# Altium schematic sheet Serial IO Interface2.SchDoc: Cypress Molson - Serial I/O Interface (Secondary)
size C; CompanyName: Linear Systems Ltd.; Organization: Linear Systems Ltd.; Address1: 1-1717 Dublin Ave.; Address2: Winnipeg, MB, Canada; Address3: R3H 0H2; DocumentNumber: LS7652; Revision: 1; SheetNumber: 11; SheetTotal: 12
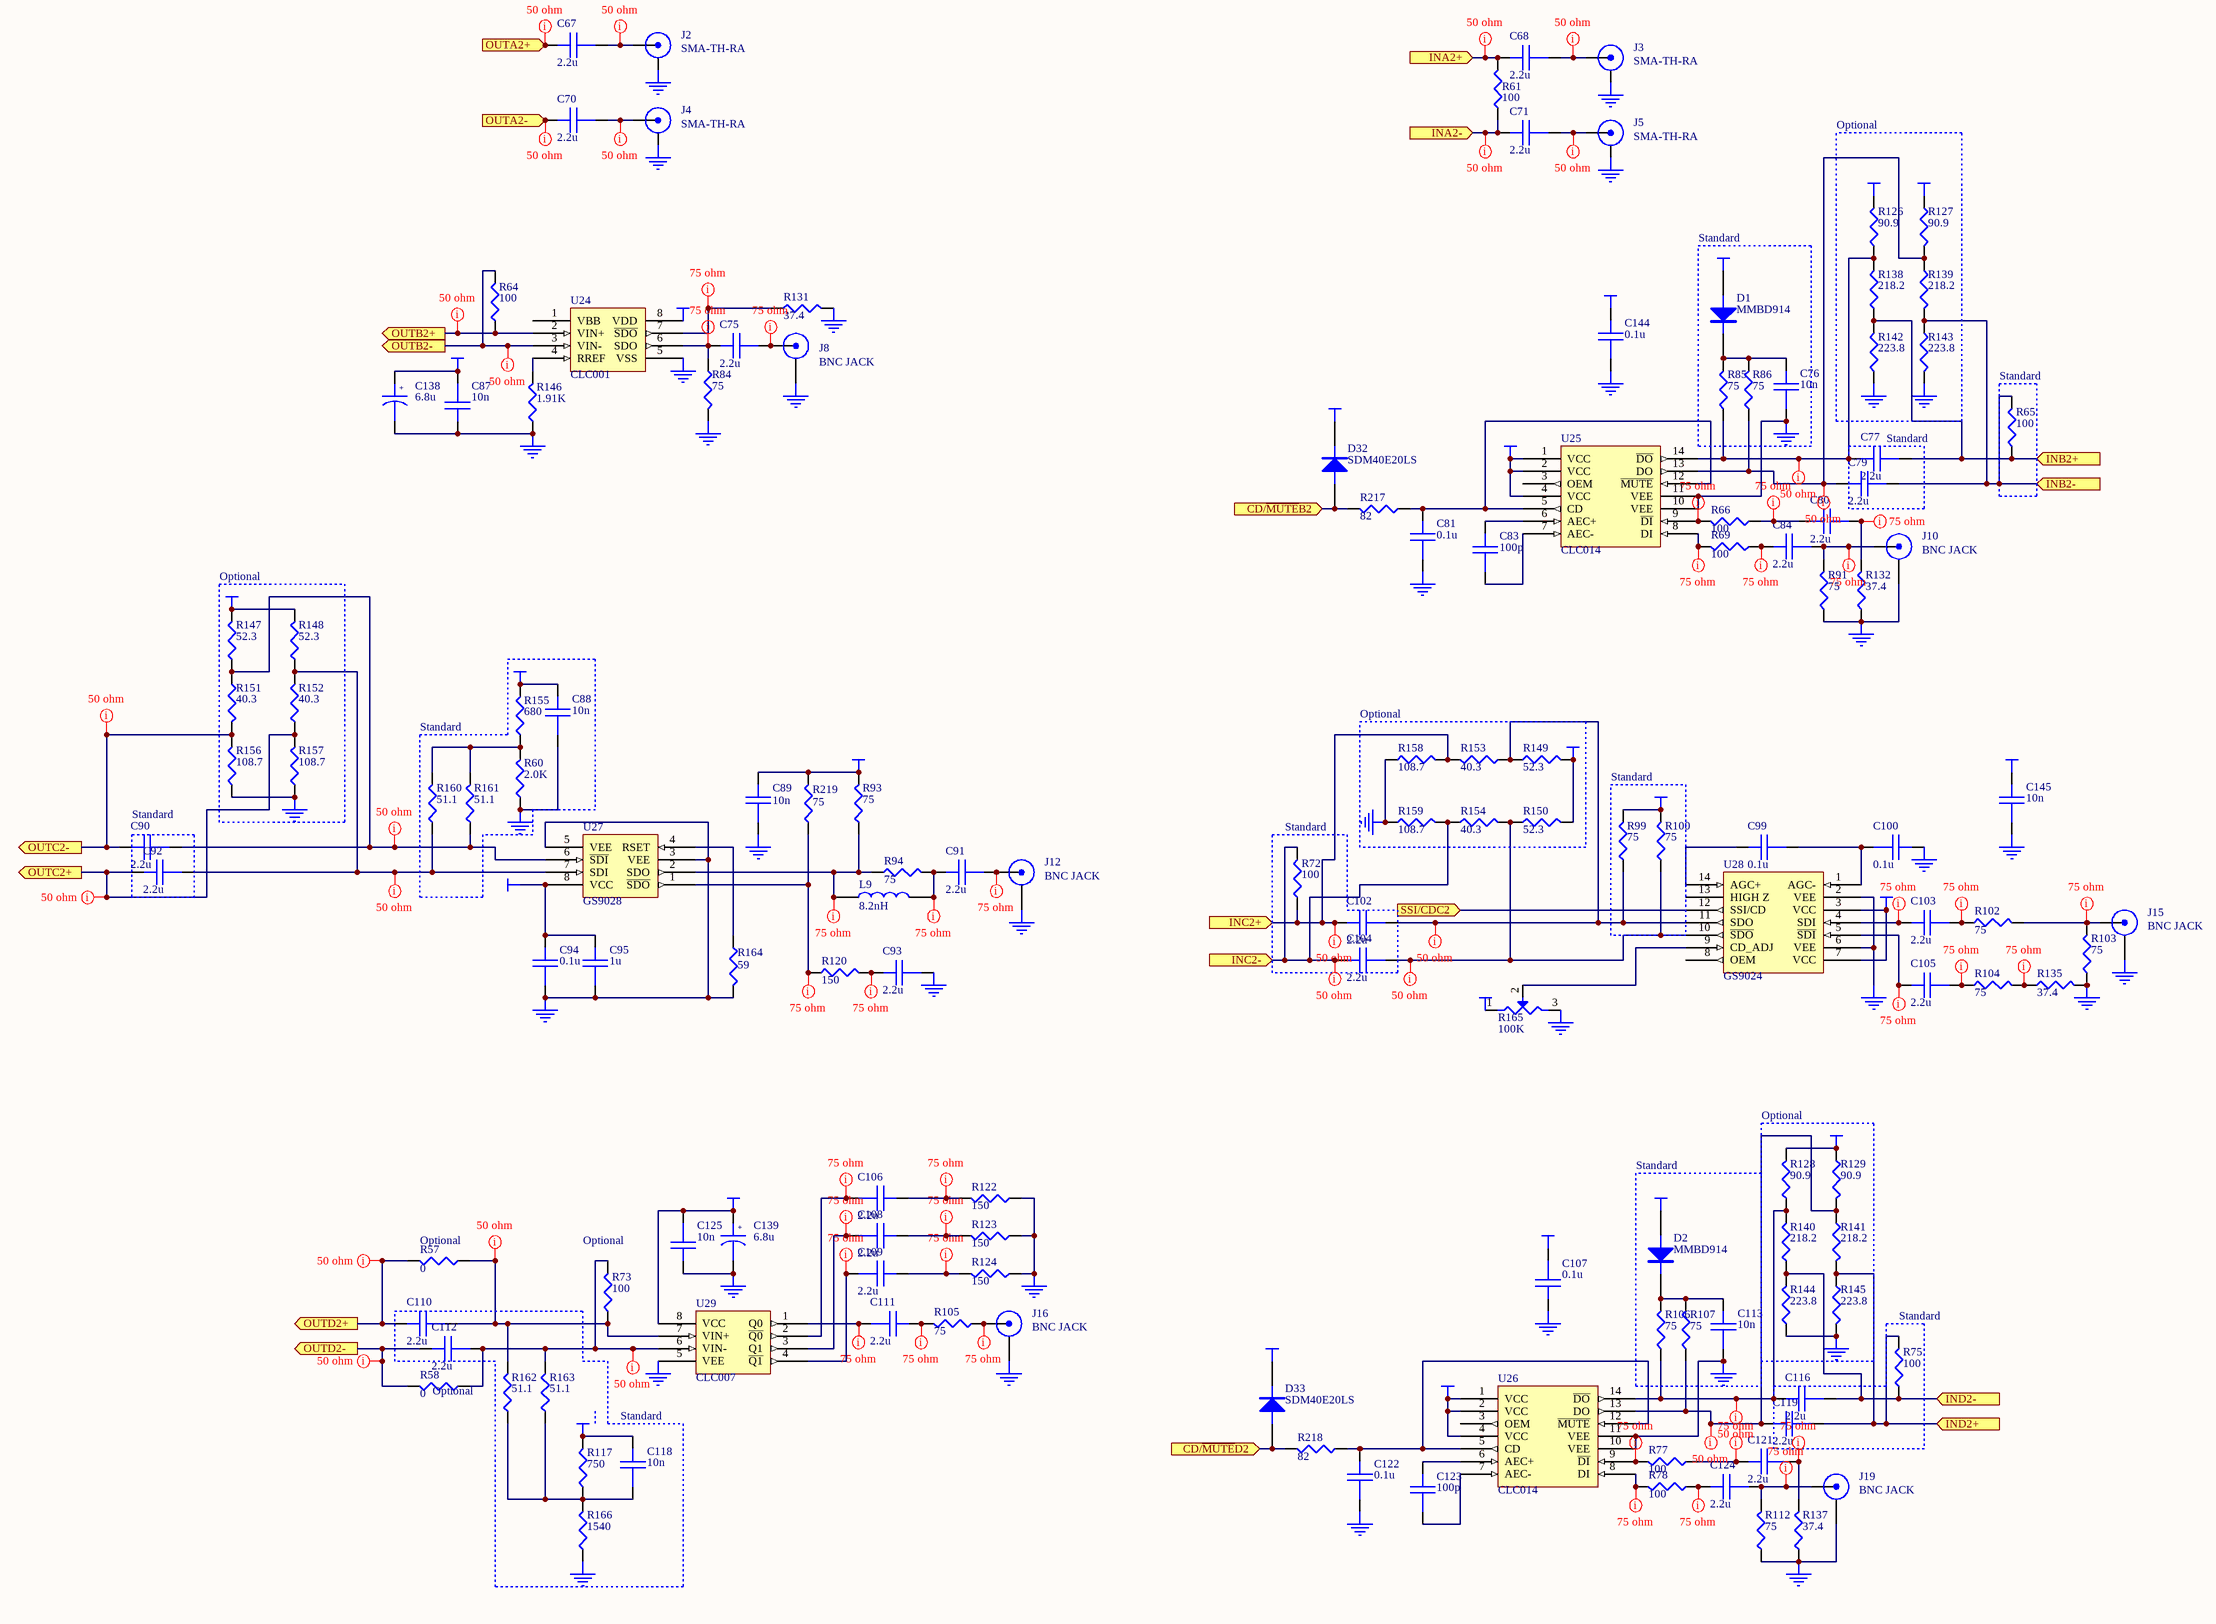
[diagram p0: Serial IO Interface2.SchDoc]

## Parts
C67  (no value)  [0603]
C68  (no value)  [0603]
C70  (no value)  [0603]
C71  (no value)  [0603]
C75  (no value)  [0603]
C76  (no value)  [0603]
C77  (no value)  [0603]
C79  (no value)  [0603]
C80  (no value)  [0603]
C81  (no value)  [0603]
C83  (no value)  [0603]
C84  (no value)  [0603]
C87  (no value)  [0603]
C88  (no value)  [0603]
C89  (no value)  [0603]
C90  (no value)  [0603]
C91  (no value)  [0603]
C92  (no value)  [0603]
C93  (no value)  [0603]
C94  (no value)  [0603]
C95  (no value)  [0805]
C99  (no value)  [0603]
C100  (no value)  [0603]
C102  (no value)  [0603]
C103  (no value)  [0603]
C104  (no value)  [0603]
C105  (no value)  [0603]
C106  (no value)  [0603]
C107  (no value)  [0603]
C108  (no value)  [0603]
C109  (no value)  [0603]
C110  (no value)  [0603]
C111  (no value)  [0603]
C112  (no value)  [0603]
C113  (no value)  [0603]
C116  (no value)  [0603]
C118  (no value)  [0603]
C119  (no value)  [0603]
C121  (no value)  [0603]
C122  (no value)  [0603]
C123  (no value)  [0603]
C124  (no value)  [0603]
C125  (no value)  [0603]
C138  6.8u  [6032]
C139  6.8u  [6032]
C144  (no value)  [0603]
C145  (no value)  [0603]
D1  MMBD914  [SOT-23]
D2  MMBD914  [SOT-23]
D32  SDM40E20LS  [SOT-23]
D33  SDM40E20LS  [SOT-23]
J2  SMA-TH-RA  [SMA-TH-RA]
J3  SMA-TH-RA  [SMA-TH-RA]
J4  SMA-TH-RA  [SMA-TH-RA]
J5  SMA-TH-RA  [SMA-TH-RA]
J8  BNC JACK  [BNC-EDGE]
J10  BNC JACK  [BNC-EDGE]
J12  BNC JACK  [BNC-EDGE]
J15  BNC JACK  [BNC-EDGE]
J16  BNC JACK  [BNC-EDGE]
J19  BNC JACK  [BNC-EDGE]
L9  8.2nH  [0805]
R57  0  [0603]
R58  0  [0603]
R60  2.0K  [0603]
R61  100  [0603]
R64  100  [0603]
R65  100  [0603]
R66  100  [0603]
R69  100  [0603]
R72  100  [0603]
R73  100  [0603]
R75  100  [0603]
R77  100  [0603]
R78  100  [0603]
R84  75  [0603]
R85  75  [0603]
R86  75  [0603]
R91  75  [0603]
R93  75  [0603]
R94  75  [0603]
R99  75  [0603]
R100  75  [0603]
R102  75  [0603]
R103  75  [0603]
R104  75  [0603]
R105  75  [0603]
R106  75  [0603]
R107  75  [0603]
R112  75  [0603]
R117  750  [0603]
R120  150  [0603]
R122  150  [0603]
R123  150  [0603]
R124  150  [0603]
R126  90.9  [0603]
R127  90.9  [0603]
R128  90.9  [0603]
R129  90.9  [0603]
R131  37.4  [0603]
R132  37.4  [0603]
R135  37.4  [0603]
R137  37.4  [0603]
R138  218.2  [0603]
R139  218.2  [0603]
R140  218.2  [0603]
R141  218.2  [0603]
R142  223.8  [0603]
R143  223.8  [0603]
R144  223.8  [0603]
R145  223.8  [0603]
R146  1.91K  [0603]
R147  52.3  [0603]
R148  52.3  [0603]
R149  52.3  [0603]
R150  52.3  [0603]
R151  40.3  [0603]
R152  40.3  [0603]
R153  40.3  [0603]
R154  40.3  [0603]
R155  680  [0603]
R156  108.7  [0603]
R157  108.7  [0603]
R158  108.7  [0603]
R159  108.7  [0603]
R160  51.1  [0603]
R161  51.1  [0603]
R162  51.1  [0603]
R163  51.1  [0603]
R164  59  [0603]
R165  100K  [POT6MM]
R166  1540  [0603]
R217  82  [0603]
R218  82  [0603]
R219  75  [0603]
U24  CLC001  [SO-8]
U25  CLC014  [SO-14]
U26  CLC014  [SO-14]
U27  GS9028  [SO-8]
U28  GS9024  [SO-14]
U29  CLC007  [SO-8]

## Blocks framed on the sheet
Optional: R126 R127 R138 R139 R142 R143
Standard: C76 D1 R85 R86
Standard: R65
Standard: C77 C79
Optional: R147 R148 R151 R152 R156 R157
Optional: R149 R150 R153 R154 R158 R159
Standard: R99 R100
Standard: C90 C92
Standard: C102 C104 R72
Optional: R128 R129 R140 R141 R144 R145
Standard: C113 D2 R106 R107
Standard: C116 C119 R75

## Ports
CD/~{MUTE}B2 (in), CD/~{MUTE}D2 (in), INA2+ (in), INA2- (in), INB2+ (in), INB2- (in), INC2+ (in), INC2- (in), IND2+ (in), IND2- (in), OUTA2+ (out), OUTA2- (out), OUTB2+ (out), OUTB2- (out), OUTC2+ (out), OUTC2- (out), OUTD2+ (out), OUTD2- (out), SSI/CDC2 (in)

## Nets
+3.3V: C87.2 C138.1 D32.3(K) D33.3(K) U24.8(VDD)
+5V: C88.1 C89.1 C94.1 C95.1 C107.2 C118.1 C125.2 C139.1 C144.1 C145.1 D1.1(A) D2.1(A) R93.2 R99.2 R100.2 R117.2 R126.2 R127.1 R128.2 R129.1 R147.2 R148.2 R149.2 R150.2 R155.2 R165.1 R219.2 U25.1(VCC) U25.2(VCC) U25.4(VCC) U26.1(VCC) U26.2(VCC) U26.4(VCC) U27.8(VCC) U28.3(VCC) U28.7(VCC) U29.8(VCC)
GND: C76.2 C81.2 C87.1 C88.2 C89.2 C93.2 C94.2 C95.2 C100.1 C107.1 C113.2 C122.2 C125.1 C138.2 C139.2 C144.2 C145.2 J2.2 J3.2 J4.2 J5.2 J8.2(GND) J10.2(GND) J12.2(GND) J15.2(GND) J16.2(GND) J19.2(GND) R60.1 R84.2 R91.1 R103.1 R112.1 R122.1 R123.1 R124.1 R131.2 R132.1 R135.2 R137.1 R142.1 R143.2 R144.1 R145.2 R146.1 R156.1 R157.1 R158.1 R159.1 R164.2 R165.3 R166.1 U24.5(VSS) U25.10(VEE) U25.11(VEE) U26.10(VEE) U26.11(VEE) U27.3(VEE) U27.5(VEE) U28.2(VEE) U28.6(VEE) U29.5(VEE)
CD/~{MUTE}B2: D32.1(A) R217.2 ; port CD/~{MUTE}B2
CD/~{MUTE}D2: D33.1(A) R218.2 ; port CD/~{MUTE}D2
INA2+: C68.1 R61.2 ; port INA2+
INA2-: C71.1 R61.1 ; port INA2-
INB2+: C77.2 R65.1 R138.1 R142.2 ; port INB2+
INB2-: C79.2 R65.2 R139.2 R143.1 ; port INB2-
INC2+: C102.1 R72.1 R153.2 R158.2 ; port INC2+
INC2-: C104.1 R72.2 R154.1 R159.2 ; port INC2-
IND2+: C119.2 R75.2 R141.2 R145.1 ; port IND2+
IND2-: C116.2 R75.1 R140.1 R144.2 ; port IND2-
OUTA2+: C67.1 ; port OUTA2+
OUTA2-: C70.1 ; port OUTA2-
OUTB2+: R64.1 U24.2(VIN+) ; port OUTB2+
OUTB2-: R64.2 U24.3(VIN-) ; port OUTB2-
OUTC2+: C92.1 R152.1 R157.2 ; port OUTC2+
OUTC2-: C90.1 R151.2 R156.2 ; port OUTC2-
OUTD2+: C110.1 R57.2 ; port OUTD2+
OUTD2-: C112.1 R58.2 ; port OUTD2-
SSI/CDC2: U28.12(SSI/CD) ; port SSI/CDC2
NetC67_2: C67.2 J2.1
NetC68_2: C68.2 J3.1
NetC70_2: C70.2 J4.1
NetC71_2: C71.2 J5.1
NetC75_1: C75.1 R84.1 U24.6(SDO)
NetC75_2: C75.2 J8.1(SIGNAL)
NetC76_1: C76.1 D1.3(K) R85.2 R86.2
NetC77_1: C77.1 R85.1 R126.1 R138.2 U25.14(~{DO})
NetC79_1: C79.1 R86.1 R127.2 R139.1 U25.13(DO)
NetC80_1: C80.1 R66.1
NetC80_2: C80.2 R132.2
NetC81_1: C81.1 R217.1 U25.5(CD) U25.12(~{MUTE})
NetC83_1: C83.1 U25.6(AEC+)
NetC83_2: C83.2 U25.7(AEC-)
NetC84_1: C84.1 R69.1
NetC84_2: C84.2 J10.1(SIGNAL) R91.2
NetC90_2: C90.2 R147.1 R151.1 R161.1 U27.6(~{SDI})
NetC91_1: C91.1 L9.2 R94.2
NetC91_2: C91.2 J12.1(SIGNAL)
NetC92_2: C92.2 R148.1 R152.2 R160.1 U27.7(SDI)
NetC93_1: C93.1 R120.2
NetC99_1: C99.1 U28.14(AGC+)
NetC99_2: C99.2 C100.2 U28.1(AGC-)
NetC102_2: C102.2 R99.1 R149.1 R153.1 U28.11(SDO)
NetC103_1: C103.1 U28.4(SDI)
NetC103_2: C103.2 R102.1
NetC104_2: C104.2 R100.1 R150.1 R154.2 U28.10(~{SDO})
NetC105_1: C105.1 U28.5(~{SDI})
NetC105_2: C105.2 R104.1
NetC106_1: C106.1 R122.2
NetC106_2: C106.2 U29.2(~{Q0})
NetC108_1: C108.1 R123.2
NetC108_2: C108.2 U29.3(Q1)
NetC109_1: C109.1 R124.2
NetC109_2: C109.2 U29.4(~{Q1})
NetC110_2: C110.2 R57.1 R73.1 R162.2 U29.7(VIN+)
NetC111_1: C111.1 R105.2
NetC111_2: C111.2 U29.1(Q0)
NetC112_2: C112.2 R58.1 R73.2 R163.2 U29.6(VIN-)
NetC113_1: C113.1 D2.3(K) R106.2 R107.2
NetC116_1: C116.1 R106.1 R128.1 R140.2 U26.14(~{DO})
NetC118_2: C118.2 R117.1 R162.1 R163.1 R166.2
NetC119_1: C119.1 R107.1 R129.2 R141.1 U26.13(DO)
NetC121_1: C121.1 R77.1
NetC121_2: C121.2 R137.2
NetC122_1: C122.1 R218.1 U26.5(CD) U26.12(~{MUTE})
NetC123_1: C123.1 U26.6(AEC+)
NetC123_2: C123.2 U26.7(AEC-)
NetC124_1: C124.1 R78.1
NetC124_2: C124.2 J19.1(SIGNAL) R112.2
NetJ15_1: J15.1(SIGNAL) R102.2 R103.2
NetJ16_1: J16.1(SIGNAL) R105.1
NetL9_1: L9.1 R93.1 R94.1 U27.2(SDO)
NetR60_2: R60.2 R155.1 R160.2 R161.2
NetR66_2: R66.2 U25.9(~{DI})
NetR69_2: R69.2 U25.8(DI)
NetR77_2: R77.2 U26.9(~{DI})
NetR78_2: R78.2 U26.8(DI)
NetR104_2: R104.2 R135.1
NetR120_1: R120.1 R219.1 U27.1(~{SDO})
NetR131_1: R131.1 U24.7(~{SDO})
NetR146_2: R146.2 U24.4(RREF)
NetR164_1: R164.1 U27.4(RSET)
NetR165_2: R165.2 U28.9(CD_ADJ)

Not connected (* = marked no-connect by the designer): U24 1(VBB); U25 3(OEM); U26 3(OEM); U28 8(OEM) 13(HIGH_Z)

## Layout directives
rule Width Constraint [Pref Width = 10mil    Min Width = 10mil    Max Width = 10mil]: INA2+, INA2-, INC2+, INC2-, NetC67_2, NetC68_2, NetC70_2, NetC71_2, NetC75_1, NetC75_2, NetC77_1, NetC79_1, NetC80_1, NetC80_2, NetC84_1, NetC84_2, NetC90_2, NetC91_1, NetC91_2, NetC92_2, NetC93_1, NetC102_2, NetC103_1, NetC103_2, NetC104_2, NetC105_1, NetC105_2, NetC106_1, NetC106_2, NetC108_1, NetC108_2, NetC109_1, NetC109_2, NetC110_2, NetC111_1, NetC111_2, NetC112_2, NetC116_1, NetC119_1, NetC121_1, NetC121_2, NetC124_1, NetC124_2, NetJ15_1, NetJ16_1, NetL9_1, NetR66_2, NetR69_2, NetR77_2, NetR78_2, NetR104_2, NetR120_1, NetR131_1, OUTA2+, OUTA2-, OUTB2+, OUTB2-, OUTC2+, OUTC2-, OUTD2+, OUTD2-

## Notes on the sheet
- Standard
- (near R57) Optional
- (near R73) Optional
- (near R58) Optional
- (near C118) Standard
- Size
- Date:
- File:
- B
- Drawing Number
- Sheet
- Drawn By:
- G. Cosens
- Revision
- of
- (in symbol CAPACITOR POL) +

## Library data of the parts
C67 C68 C70 C71 C75-C77 C79-C81 C83 C84 C87-C95 C99 C100 C102-C113 C116 C118 C119 C121-C125 C144 C145 = CAP: SMT CAP
C138 C139 = CAPACITOR POL: Text Field1: 20; Text Field2: 20
D1 D2 D32 D33 = MMBD914: High Conductance Ultra Fast Diode
J2-J5 = SMA-TH-RA: BNC
L9 = INDUCTOR1
R57 R58 R60 R61 R64-R66 R69 R72 R73 R75 R77 R78 R84-R86 R91 R93 R94 R99 R100 R102-R107 R112 R117 R120 R122-R124 R126-R129 R131 R132 R135 R137-R164 R166 R217-R219 = RES1
R165 = POT